# Altium schematic sheet Button.SchDoc
size A; SheetNumber: 1; SheetTotal: 1
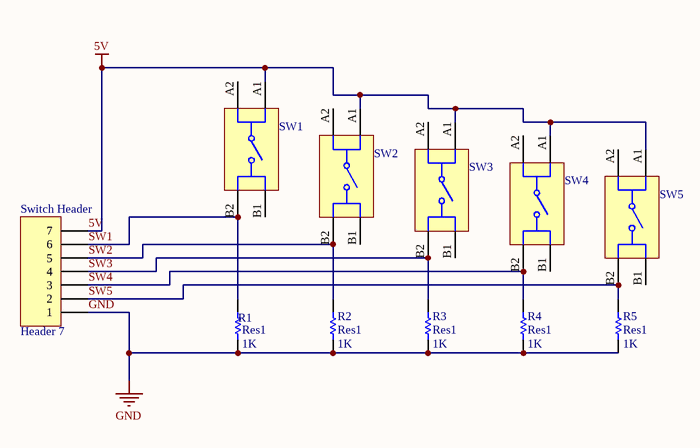
[diagram p0: Button.SchDoc]

## Parts
R1  Res1  value 1K  [AXIAL-0.3]
R2  Res1  value 1K  [AXIAL-0.3]
R3  Res1  value 1K  [AXIAL-0.3]
R4  Res1  value 1K  [AXIAL-0.3]
R5  Res1  value 1K  [AXIAL-0.3]
SW1  430172073816  [WS-TASV_L12W12H7.3_4301x20738x6]  (value not drawn)
SW2  430172073816  [WS-TASV_L12W12H7.3_4301x20738x6]  (value not drawn)
SW3  430172073816  [WS-TASV_L12W12H7.3_4301x20738x6]  (value not drawn)
SW4  430172073816  [WS-TASV_L12W12H7.3_4301x20738x6]  (value not drawn)
SW5  430172073816  [WS-TASV_L12W12H7.3_4301x20738x6]  (value not drawn)
Switch_Header  Header 7  [HDR1X7]

## Nets
5V: SW1.A1 SW2.A1 SW3.A1 SW4.A1 SW5.A1 Switch_Header.7
GND: R1.2 R2.2 R3.2 R4.2 R5.2 Switch_Header.1
SW1: R1.1 SW1.B2 Switch_Header.6
SW2: R2.1 SW2.B2 Switch_Header.5
SW3: R3.1 SW3.B2 Switch_Header.4
SW4: R4.1 SW4.B2 Switch_Header.3
SW5: R5.1 SW5.B2 Switch_Header.2

Not connected (* = marked no-connect by the designer): SW1 A2 B1; SW2 A2 B1; SW3 A2 B1; SW4 A2 B1; SW5 A2 B1

## Library data of the parts
R1-R5 = Res1: Resistor; Published: 8-Jun-2000; LatestRevisionDate: 17-Jul-2002; LatestRevisionNote: Re-released for DXP Platform.; PackageReference: AXIAL-0.3; Publisher: Altium Limited; PackageDescription: Axial Device, Thru-Hole; 2 Leads; 0.3 in Pin Spacing
SW1-SW5 = 430172073816: WS-TASV SMT Tact Switch, L12 x W12 x H7.3mm, 160g, SPST-NO, 12V, 50mA; Manufacturer: Wurth Elektronik; Washable: No; Manufacturer Part Number: 430172073816; Category: Tact Switches; Match Code: WS-TASV; ComponentLink1Description: Website Link; ComponentLink1URL: https://www.we-online.com/redexpert/article/430172073816?ad; ComponentLink2Description: Datasheet Link; ComponentLink2URL: https://www.we-online.com/redexpert/spec/430172073816?ad; Mount: Surface Mount; Operating Temperature Max: 85°C; Operating Temperature Min: -40°C; Packaging: Tape and Reel; Length: 12mm; Width: 12mm; Height: 7.3mm; Circuit: SPST-NO; Contact Material: Stainless Steel; Contact Plating: Silver; Operation Force: 160g; Rated Current: 50mA; Rated Voltage (DC): 12V; Terminal Material: Copper Alloy; Terminal Plating: Silver
Switch_Header = Header 7: Header, 7-Pin; LatestRevisionDate: 17-Jul-2002; LatestRevisionNote: Re-released for DXP Platform.; Publisher: Altium Limited